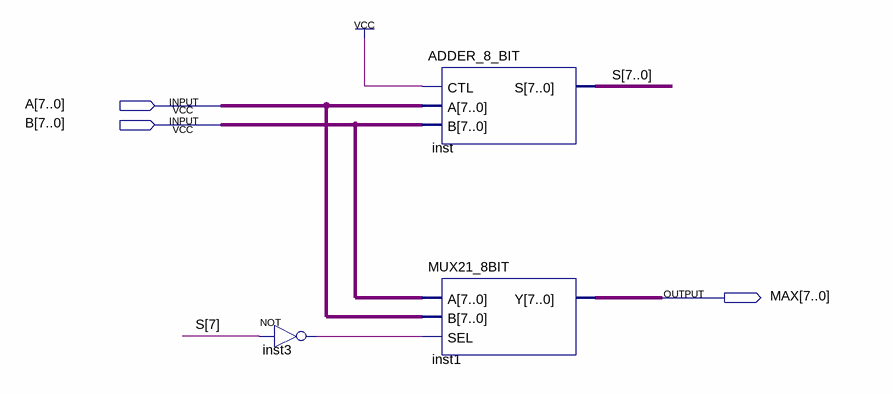
[diagram p0: schematic sheet]
// Quartus schematic MAX_UNIT.bdf as structural Verilog: 3 symbols, 3 pins
module MAX_UNIT (
  input  [7:0] A,
  input  [7:0] B,
  output [7:0] MAX
);

  wire inst3_out;
  wire [7:0] S;

  not inst3 (inst3_out, S[7]);
  ADDER_8_BIT inst (.CTL(1'b1), .A(A), .B(B), .S(S));
  MUX21_8BIT inst1 (.A(B), .B(A), .SEL(inst3_out), .Y(MAX));
endmodule
